# EAGLE design gol (EAGLE 9.6.2)
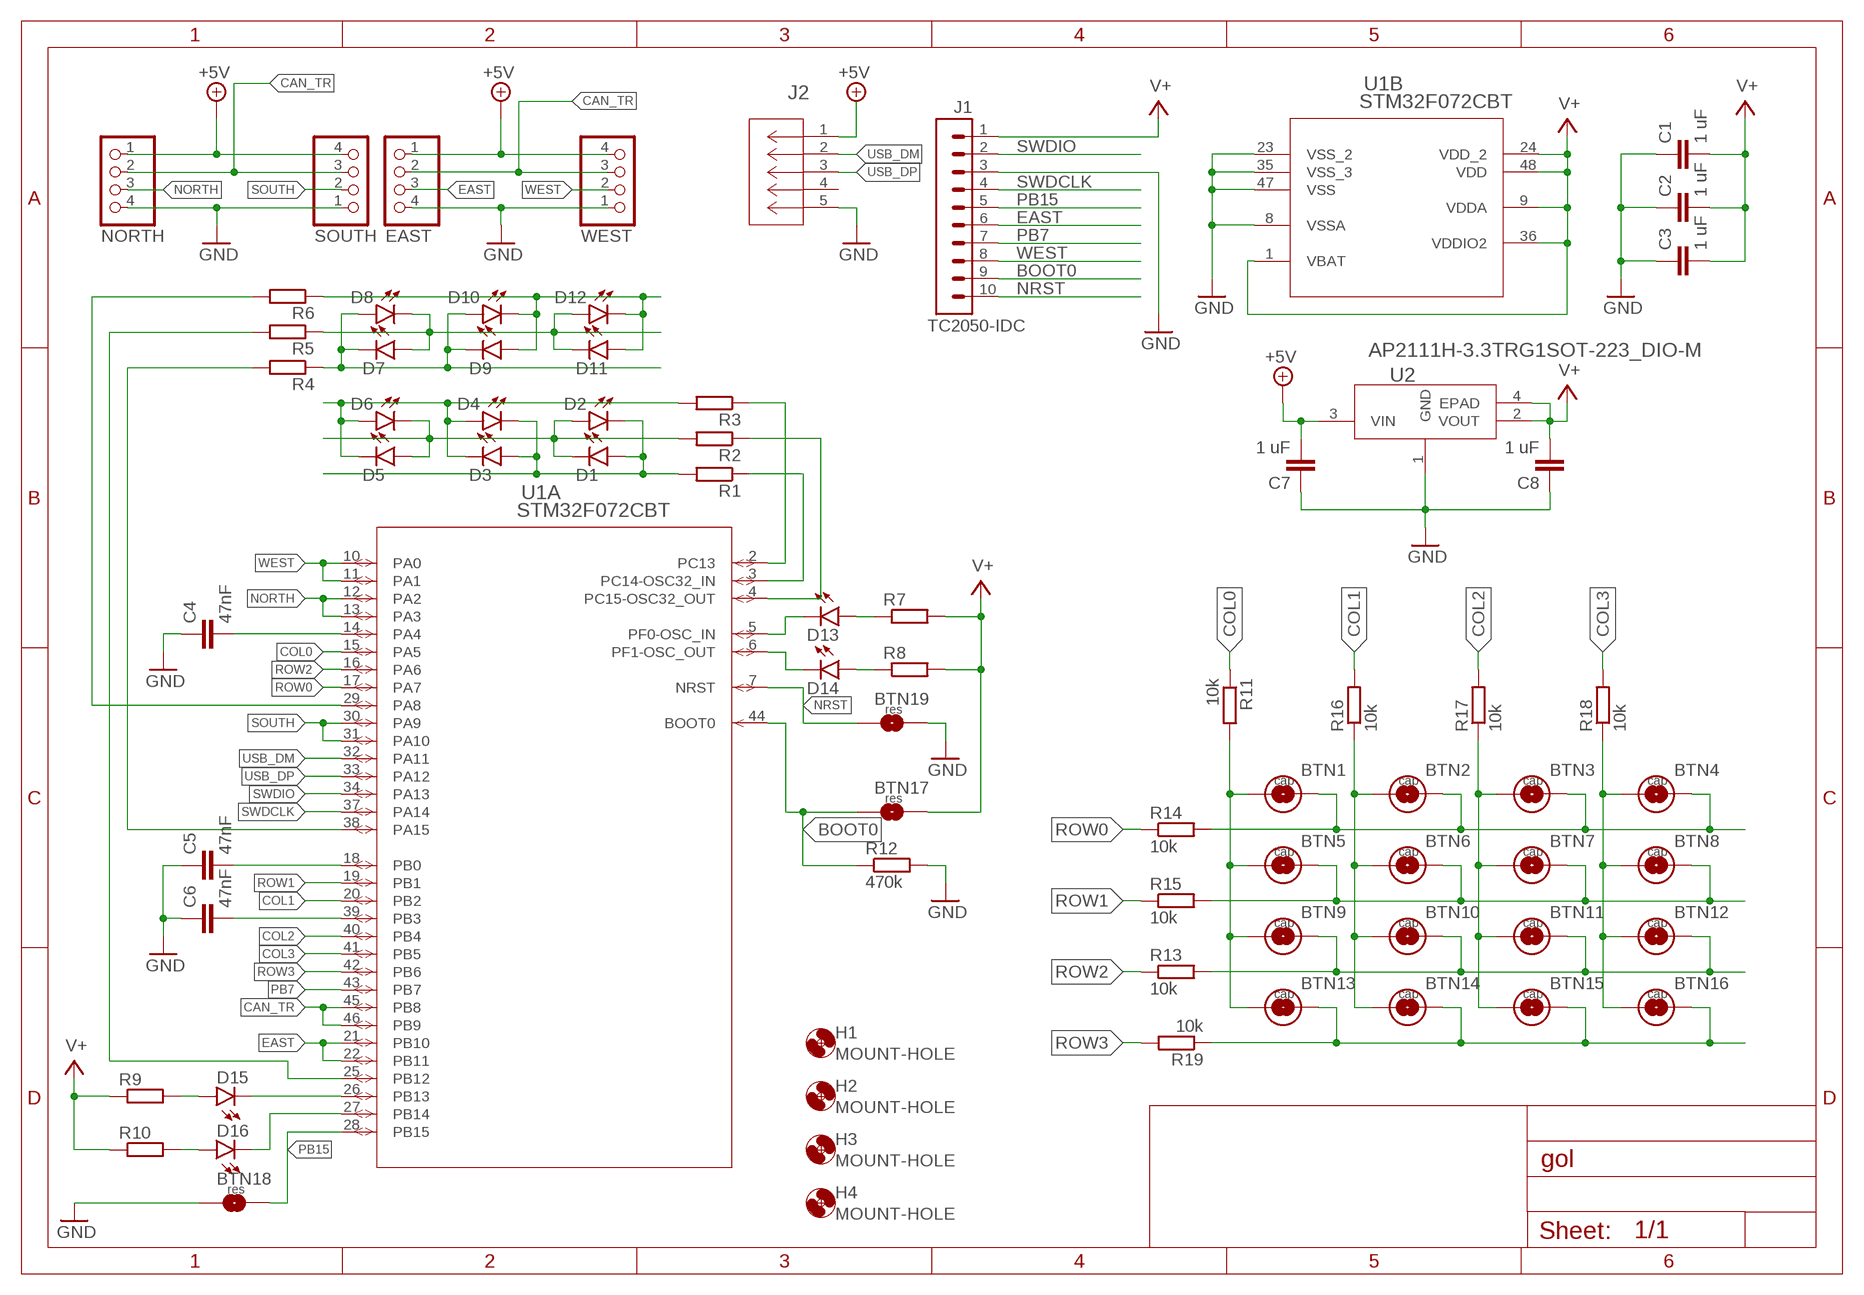
[diagram p0: schematic, sheet 1]

## Parts
BTN1  BUTTON-CAP  [COMB]
BTN2  BUTTON-CAP  [COMB]
BTN3  BUTTON-CAP  [COMB]
BTN4  BUTTON-CAP  [COMB]
BTN5  BUTTON-CAP  [COMB]
BTN6  BUTTON-CAP  [COMB]
BTN7  BUTTON-CAP  [COMB]
BTN8  BUTTON-CAP  [COMB]
BTN9  BUTTON-CAP  [COMB]
BTN10  BUTTON-CAP  [COMB]
BTN11  BUTTON-CAP  [COMB]
BTN12  BUTTON-CAP  [COMB]
BTN13  BUTTON-CAP  [COMB]
BTN14  BUTTON-CAP  [COMB]
BTN15  BUTTON-CAP  [COMB]
BTN16  BUTTON-CAP  [COMB]
BTN17  FLASH  BUTTON-RES  [COMB_EXPOSED]
BTN18  MENU  BUTTON-RES  [COMB_EXPOSED]
BTN19  RESET  BUTTON-RES  [COMB_EXPOSED]
C1  1 uF  C-EUC0603  [C0603]
C2  1 uF  C-EUC0603  [C0603]
C3  1 uF  C-EUC0603  [C0603]
C4  47nF  C-EUC0603  [C0603]
C5  47nF  C-EUC0603  [C0603]
C6  47nF  C-EUC0603  [C0603]
C7  1 uF  C-EUC0603  [C0603]
C8  1 uF  C-EUC0603  [C0603]
D1  LED-5MM  [LED5MM]
D2  LED-5MM  [LED5MM]
D3  LED-5MM  [LED5MM]
D4  LED-5MM  [LED5MM]
D5  LED-5MM  [LED5MM]
D6  LED-5MM  [LED5MM]
D7  LED-5MM  [LED5MM]
D8  LED-5MM  [LED5MM]
D9  LED-5MM  [LED5MM]
D10  LED-5MM  [LED5MM]
D11  LED-5MM  [LED5MM]
D12  LED-5MM  [LED5MM]
D13  LED-5MM  [LED5MM]
D14  LED-5MM  [LED5MM]
D15  LED-5MM  [LED5MM]
D16  LED-5MM  [LED5MM]
EAST  EAST  PINHD-1X04  [1X04]
H1  MOUNT-HOLE  [MOUNT-HOLE-2,8]
H2  MOUNT-HOLE  [MOUNT-HOLE-2,8]
H3  MOUNT-HOLE  [MOUNT-HOLE-2,8]
H4  MOUNT-HOLE  [MOUNT-HOLE-2,8]
J1  TC2050-IDC  [TC2050-IDC]
J2  2057-MCR-B-S-RA-TSMT-NP-CS4-T/RCT-ND  10118192-0002LFCONN_10118192-0002LF_AMP  [CONN_10118192-0002LF_AMP]
NORTH  NORTH  PINHD-1X041X04-RA-FEM  [JP4-RA-FEM]
R1  R-EU-0207/8  [0207/8]
R2  R-EU-0207/8  [0207/8]
R3  R-EU-0207/8  [0207/8]
R4  R-EU-0207/8  [0207/8]
R5  R-EU-0207/8  [0207/8]
R6  R-EU-0207/8  [0207/8]
R7  R-EU-0207/8  [0207/8]
R8  R-EU-0207/8  [0207/8]
R9  R-EU-0207/8  [0207/8]
R10  R-EU-0207/8  [0207/8]
R11  10k  R-EU_R0603  [R0603]
R12  470k  R-EU_R0603  [R0603]
R13  10k  R-EU_R0603  [R0603]
R14  10k  R-EU_R0603  [R0603]
R15  10k  R-EU_R0603  [R0603]
R16  10k  R-EU_R0603  [R0603]
R17  10k  R-EU_R0603  [R0603]
R18  10k  R-EU_R0603  [R0603]
R19  10k  R-EU_R0603  [R0603]
SOUTH  SOUTH  PINHD-1X4/90  [1X04/90]
U1  STM32F072CBT  STM32F072CBT6LQFP48-7X7MM  [LQFP48-7X7MM]
U2  AP2111H-3.3TRG1SOT-223_DIO-M  [SOT-223_DIO-M]
WEST  WEST  PINHD-1X04  [1X04]

## Nets
+5V: C7.2 EAST.1 J2.1 NORTH.1 SOUTH.4 U2.3(VIN) WEST.4
BOOT0: BTN17.P$1 J1.9 R12.1 U1.44(A:BOOT0)
CAN_TR: EAST.2 NORTH.2 SOUTH.3 U1.45(A:PB8) U1.46(A:PB9) WEST.3
COL0: R11.1 U1.15(A:PA5)
COL1: R16.2 U1.20(A:PB2)
COL2: R17.2 U1.40(A:PB4)
COL3: R18.2 U1.41(A:PB5)
EAST: EAST.3 J1.6 U1.21(A:PB10) U1.22(A:PB11)
GND: BTN18.P$1 BTN19.P$2 C1.1 C2.1 C3.1 C4.1 C5.1 C6.1 C7.1 C8.1 EAST.4 J1.3 J2.5 NORTH.4 R12.2 SOUTH.1 U1.8(B:VSSA) U1.23(B:VSS_2) U1.35(B:VSS_3) U1.47(B:VSS) U2.1(GND) WEST.1
IN_COL0: BTN1.P$1 BTN5.P$1 BTN9.P$1 BTN13.P$1 R11.2
IN_COL1: BTN2.P$1 BTN6.P$1 BTN10.P$1 BTN14.P$1 R16.1
IN_COL2: BTN3.P$1 BTN7.P$1 BTN11.P$1 BTN15.P$1 R17.1
IN_COL3: BTN4.P$1 BTN8.P$1 BTN12.P$1 BTN16.P$1 R18.1
IN_ROW0: BTN1.P$2 BTN2.P$2 BTN3.P$2 BTN4.P$2 R14.2
IN_ROW1: BTN5.P$2 BTN6.P$2 BTN7.P$2 BTN8.P$2 R15.2
IN_ROW2: BTN9.P$2 BTN10.P$2 BTN11.P$2 BTN12.P$2 R13.2
IN_ROW3: BTN13.P$2 BTN14.P$2 BTN15.P$2 BTN16.P$2 R19.1
N$1: C4.2 U1.14(A:PA4)
N$2: C5.2 U1.18(A:PB0)
N$3: C6.2 U1.39(A:PB3)
N$4: D1.A D2.K(C) D3.A D4.K(C) R1.2
N$5: D1.K(C) D2.A D5.A D6.K(C) R2.2
N$6: D3.K(C) D4.A D5.K(C) D6.A R3.2
N$13: D7.K(C) D8.A D9.K(C) D10.A R4.1
N$14: D7.A D8.K(C) D11.K(C) D12.A R5.1
N$15: D9.A D10.K(C) D11.A D12.K(C) R6.1
N$18: D13.A R7.1
N$19: D14.A R8.1
N$22: D15.A R9.2
N$23: D16.A R10.2
NORTH: NORTH.3 U1.12(A:PA2) U1.13(A:PA3)
NRST: BTN19.P$1 J1.10 U1.7(A:NRST)
OUTA-L1: R3.1 U1.2(A:PC13)
OUTA-L2: R1.1 U1.3(A:PC14-OSC32_IN)
OUTA-L3: R2.1 U1.4(A:PC15-OSC32_OUT)
OUTB-L1: R4.2 U1.38(A:PA15)
OUTB-L2: R5.2 U1.25(A:PB12)
OUTB-L3: R6.2 U1.29(A:PA8)
OUTD13: D13.K(C) U1.5(A:PF0-OSC_IN)
OUTD14: D14.K(C) U1.6(A:PF1-OSC_OUT)
OUTD15: D15.K(C) U1.26(A:PB13)
OUTD16: D16.K(C) U1.27(A:PB14)
PB7: J1.7 U1.43(A:PB7)
PB15: BTN18.P$2 J1.5 U1.28(A:PB15)
ROW0: R14.1 U1.17(A:PA7)
ROW1: R15.1 U1.19(A:PB1)
ROW2: R13.1 U1.16(A:PA6)
ROW3: R19.2 U1.42(A:PB6)
SOUTH: SOUTH.2 U1.30(A:PA9) U1.31(A:PA10)
SWDCLK: J1.4 U1.37(A:PA14)
SWDIO: J1.2 U1.34(A:PA13)
USB_DM: J2.2 U1.32(A:PA11)
USB_DP: J2.3 U1.33(A:PA12)
V+: BTN17.P$2 C1.2 C2.2 C3.2 C8.2 J1.1 R7.2 R8.2 R9.1 R10.1 U1.1(B:VBAT) U1.9(B:VDDA) U1.24(B:VDD_2) U1.36(B:VDDIO2) U1.48(B:VDD) U2.2(VOUT) U2.4(EPAD)
WEST: J1.8 U1.10(A:PA0) U1.11(A:PA1) WEST.2
Unconnected: J2.4

## Library data of the parts
BTN1-BTN16 = parts:BUTTON-CAP
BTN17-BTN19 = parts:BUTTON-RES
C1-C8 = rcl:C-EU: CAPACITOR, European symbol; SPICEPREFIX: C
D1-D16 = parts:LED-5MM
EAST NORTH WEST = parts:PINHD-1X04
H1-H4 = parts:MOUNT-HOLE
J1 = tcs:TC2050-IDC: Tag Connect 10-pin header
J2 = parts:10118192-0002LF; COPYRIGHT: Copyright (C) 2023 Ultra Librarian. All rights reserved.; DIGIKEY_PART_1: 609-5379-1-ND; DIGIKEY_PART_2: 2057-MCR-B-S-RA-TSMT-NP-CS4-T/RCT-ND; MANUFACTURER_PART_NUMBER: 10118192-0002LF; MFR_NAME: Amphenol ICC
R1-R10 = parts:R-EU-0207/8
R11-R19 = rcl:R-EU_: RESISTOR, European symbol; SPICEPREFIX: R
SOUTH = pinhead:PINHD-1X4: PIN HEADER
U1 = 2023-06-09_13-17-44_Library:STM32F072CBT6; COPYRIGHT: Copyright (C) 2023 Ultra Librarian. All rights reserved.; MANUFACTURER_PART_NUMBER: STM32F072CBT6; MFR_NAME: STMicroelectronics
U2 = parts:AP2111H-3.3TRG1; COPYRIGHT: Copyright (C) 2023 Ultra Librarian. All rights reserved.; MANUFACTURER_PART_NUMBER: AP2111H-3.3TRG1; MFR_NAME: Diodes Inc

## Board
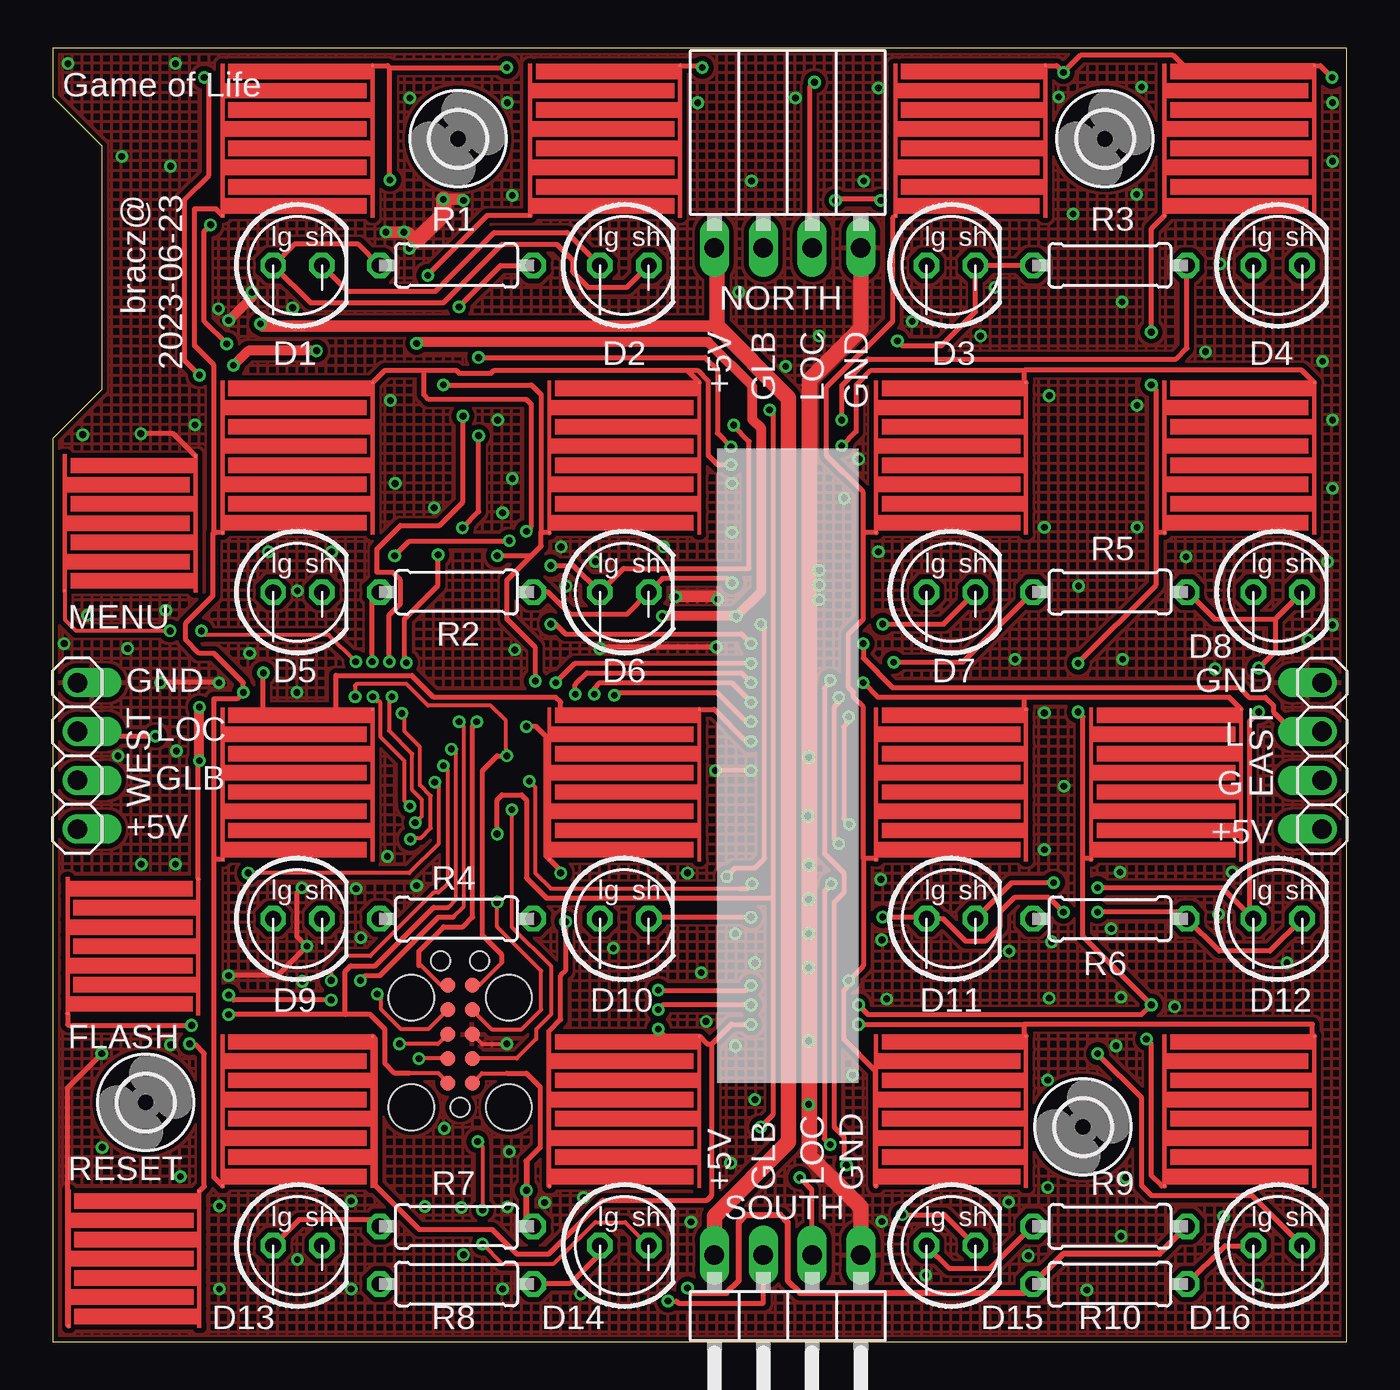
[diagram p1: board, top side]
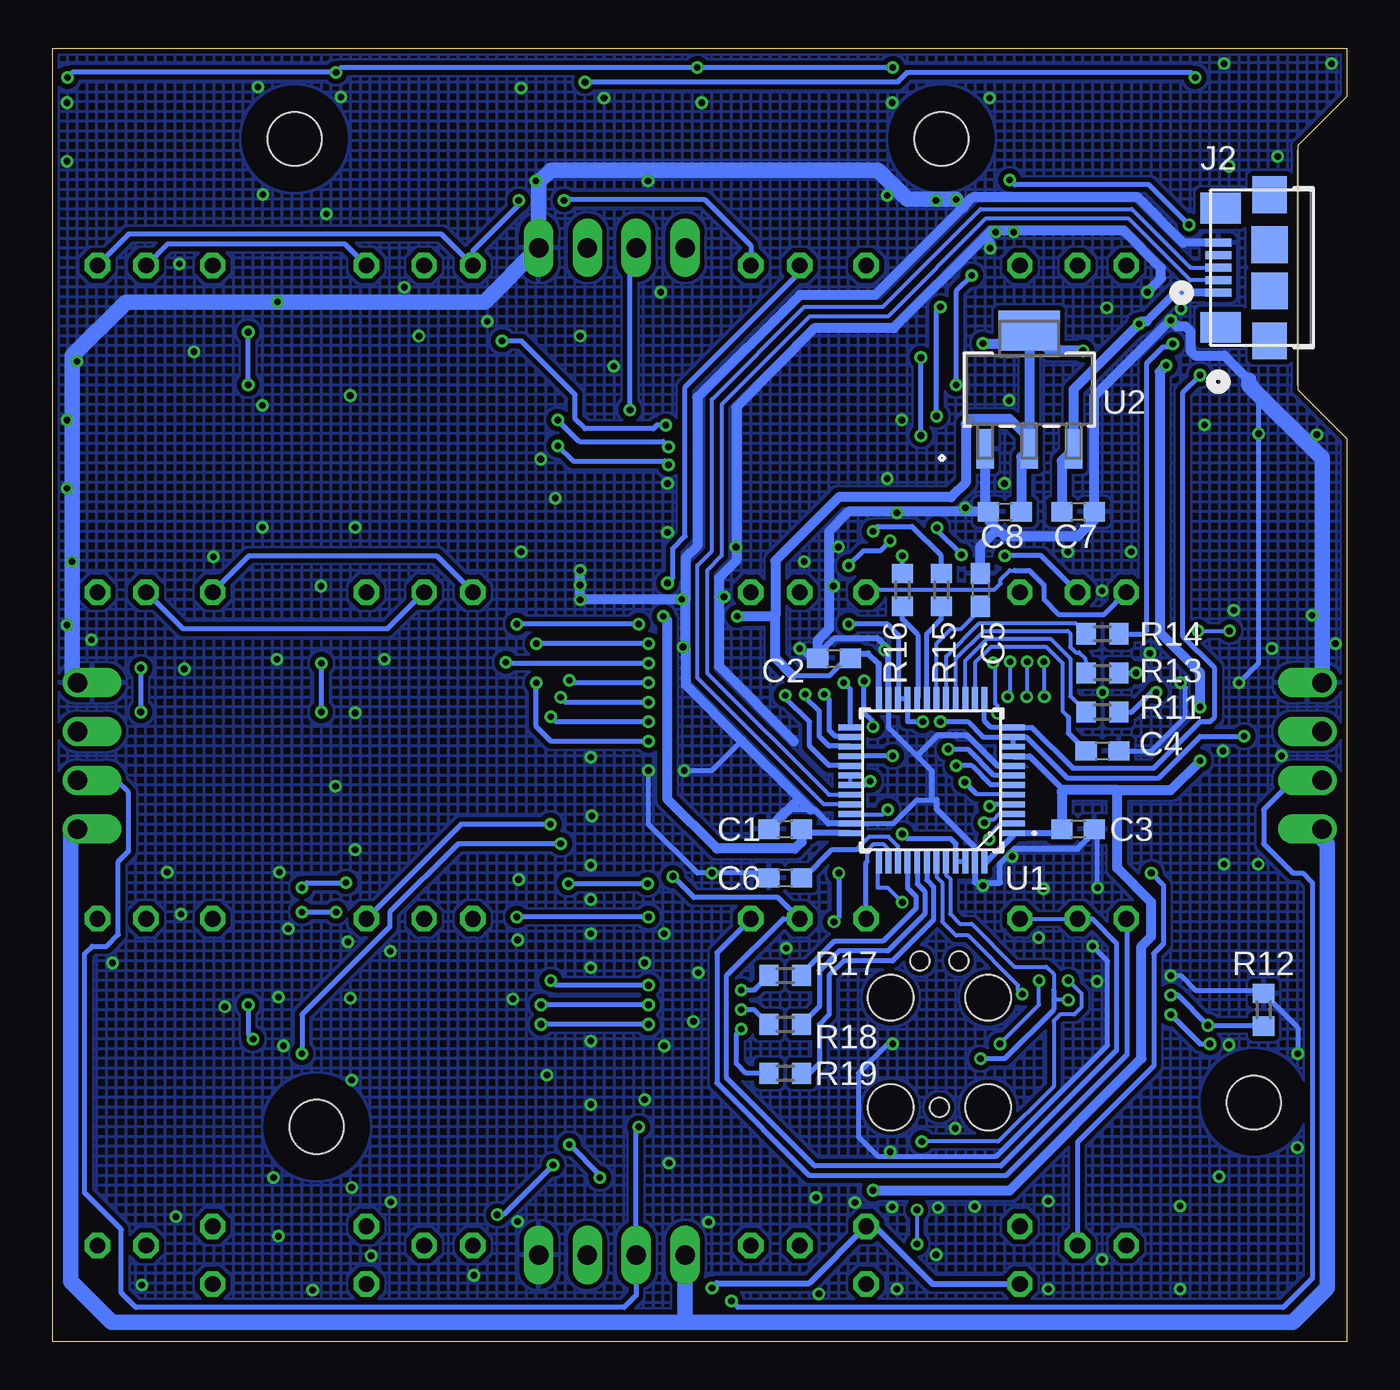
[diagram p2: board, bottom side, seen from below]

Size 67.31 x 67.31 mm. Coordinates in mm from the lower left corner, seen from the top.
Outline: 0,0 67.31,0 67.31,67.31 0,67.31 0,64.77 2.54,62.23 2.54,49.53 0,46.99 0,0
Copper layers (1*16): Top 0.035mm / dielectric 1.5mm / Bottom 0.035mm
Design rules "SeeedStudio_2layer_DRU_no_angle_20140221": minimum track width 6mil, minimum drill 12mil, track to track 6mil, track to pad 6mil, pad to pad 6mil, via to via 6mil, smd to smd 0mil, copper to edge 10mil, drill to drill 10mil, minimum pad ring 10mil, minimum via ring 6mil, stop-mask expansion 2mil, vias tented up to drill 100mil, thermal gap 10mil

### Footprints (pad centres in the part's own frame; a part is rotated, then mirrored left to right if it is on the bottom)
COMB = smd 0.1 x 0.1: P$1 -3.9,-3.9; P$2 3.9,3.9
COMB_EXPOSED = smd 0.1 x 0.1: P$1 -3.3,-3.5; P$2 3.5,3.5
C0603 = smd 1.1 x 1: 1 -0.85,0; 2 0.85,0
LED5MM = drill 0.813 octagon: A -1.27,0; K 1.27,0
1X04 = drill 1.016 offset: 1 -3.81,0; 2 -1.27,0; 3 1.27,0; 4 3.81,0
MOUNT-HOLE-2,8 = hole 2.8: 0,0
TC2050-IDC = smd 0.787 x 0.787: 1 -2.54,-0.635; 2 -1.27,-0.635; 3 0,-0.635; 4 1.27,-0.635; 5 2.54,-0.635; 6 2.54,0.635; 7 1.27,0.635; 8 0,0.635; 9 -1.27,0.635; 10 -2.54,0.635 | hole 0.991: -3.81,0; 3.81,1.016; 3.81,-1.016 | hole 2.375: -3.81,-2.54; 1.905,-2.54; 1.905,2.54; -3.81,2.54
CONN_10118192-0002LF_AMP = smd 0.406 x 1.346: 1 -1.3,2.204; 2 -0.65,2.204; 3 0,2.204; 4 0.65,2.204; 5 1.3,2.204 | smd 1.6 x 2.108: 6 -3.1,2.079; 7 3.1,2.079 | smd 1.905 x 1.803: 8 -3.8,-0.471; 9 3.8,-0.471 | smd 1.905 x 1.905: 10 -1.2,-0.471; 11 1.2,-0.471
JP4-RA-FEM = drill 1.016 long: 1 -3.81,-3.81; 2 -1.27,-3.81; 3 1.27,-3.81; 4 3.81,-3.81
0207/8 = drill 0.813 octagon: 1 -4,0; 2 4,0
R0603 = smd 1 x 1.1: 1 -0.85,0; 2 0.85,0
1X04/90 = drill 1.016 long: 1 -3.81,-3.81; 2 -1.27,-3.81; 3 1.27,-3.81; 4 3.81,-3.81
LQFP48-7X7MM = smd 1.194 x 0.305: 1 -4.25,2.75; 2 -4.25,2.25; 3 -4.25,1.75; 4 -4.25,1.25; 5 -4.25,0.75; 6 -4.25,0.25; 7 -4.25,-0.25; 8 -4.25,-0.75; 9 -4.25,-1.25; 10 -4.25,-1.75; 11 -4.25,-2.25; 12 -4.25,-2.75; 25 4.25,-2.75; 26 4.25,-2.25; 27 4.25,-1.75; 28 4.25,-1.25; 29 4.25,-0.75; 30 4.25,-0.25; 31 4.25,0.25; 32 4.25,0.75; 33 4.25,1.25; 34 4.25,1.75; 35 4.25,2.25; 36 4.25,2.75 | smd 0.305 x 1.194: 13 -2.75,-4.25; 14 -2.25,-4.25; 15 -1.75,-4.25; 16 -1.25,-4.25; 17 -0.75,-4.25; 18 -0.25,-4.25; 19 0.25,-4.25; 20 0.75,-4.25; 21 1.25,-4.25; 22 1.75,-4.25; 23 2.25,-4.25; 24 2.75,-4.25; 37 2.75,4.25; 38 2.25,4.25; 39 1.75,4.25; 40 1.25,4.25; 41 0.75,4.25; 42 0.25,4.25; 43 -0.25,4.25; 44 -0.75,4.25; 45 -1.25,4.25; 46 -1.75,4.25; 47 -2.25,4.25; 48 -2.75,4.25
SOT-223_DIO-M = smd 0.902 x 2.066: 1 -2.3,-3.076; 2 0,-3.076; 3 2.3,-3.076 | smd 3.202 x 2.066: 4 0,3.076

### Placement (x,y rotation side)
BTN1  12.73,62.49 0 top
BTN2  28.73,62.49 0 top
BTN3  47.73,62.49 0 top
BTN4  61.73,62.49 0 top
BTN5  12.73,46 0 top
BTN6  29.73,46 0 top
BTN7  46.73,46 0 top
BTN8  61.73,46 0 top
BTN9  12.73,29 0 top
BTN10  29.73,29 0 top
BTN11  46.73,29 0 top
BTN12  57.92,29 0 top
BTN13  12.73,12 0 top
BTN14  29.73,12 0 top
BTN15  46.73,12 0 top
BTN16  61.73,12 0 top
BTN17  4.06,20.57 0 top
BTN18  4.12,42.59 180 top
BTN19  4.32,4.32 180 top
C1  29.21,26.67 0 bottom
C2  26.67,35.56 0 bottom
C3  13.97,26.67 180 bottom
C4  12.7,30.73 180 bottom
C5  19.05,39.12 270 bottom
C6  29.21,24.13 0 bottom
C7  13.97,43.18 180 bottom
C8  17.78,43.18 0 bottom
D1  12.73,56 0 top
D2  29.73,56 0 top
D3  46.73,56 0 top
D4  63.73,56 0 top
D5  12.73,39 0 top
D6  29.73,39 0 top
D7  46.73,39 0 top
D8  63.73,39 0 top
D9  12.73,22 0 top
D10  29.73,22 0 top
D11  46.73,22 0 top
D12  63.73,22 0 top
D13  12.73,5 0 top
D14  29.73,5 0 top
D15  46.73,5 0 top
D16  63.73,5 0 top
EAST  66.04,30.48 90 top
H1  54.74,62.59 0 top
H2  53.59,11.18 0 top
H3  4.83,12.45 0 top
H4  21.08,62.59 0 top
J1  21.18,16 90 top
J2  4.47,55.88 90 bottom
NORTH  38.23,60.73 0 top
R1  21,56 180 top
R2  21,39 0 top
R3  55,56 180 top
R4  21,22 0 top
R5  55,39 180 top
R6  55,22 180 top
R7  21,6 0 top
R8  21,3 180 top
R9  55,6 180 top
R10  55,3 0 top
R11  12.7,32.77 0 bottom
R12  4.32,17.27 90 bottom
R13  12.7,34.8 0 bottom
R14  12.7,36.83 0 bottom
R15  21.08,39.12 90 bottom
R16  23.11,39.12 270 bottom
R17  29.21,19.05 0 bottom
R18  29.21,16.51 0 bottom
R19  29.21,13.97 0 bottom
SOUTH  38.23,0.7 180 top
U1  21.59,29.21 180 bottom
U2  16.51,49.53 0 bottom
WEST  1.27,30.48 270 top

### Tracks (layer width: path | path; a pad name or v marks a point on that pad's centre or on a via)
+5V  (via drill 0.35)
  Top 0.61: v10.79,52.96 10.92,52.83 34.54,52.83
  Top 0.813: NORTH.1 34.54,56.8 34.54,52.83 38.28,49.1 38.28,10.39 34.42,6.53 SOUTH.4
  Bottom 0.406: J2.1 8.92,54.58 10.41,53.09
  Bottom 0.508: 10.41,53.09 10.67,53.09 v10.79,52.96 14.21,49.54 U2.3 14.82,45.84 C7.2
  Bottom 0.813: WEST.4 1.27,26.16 1.02,25.91 1.02,2.79 2.79,1.02 34.29,1.02 | 34.29,1.02 34.42,1.15 SOUTH.4 | EAST.1 66.4,26.31 66.4,3.15 64.26,1.02 34.29,1.02
BOOT0  (via drill 0.35)
  Top 0.203: J1.9 v19.05,14.73
  Top 0.254: BTN17.P$1 0.76,16.51 0.81,16.46 v7.21,16.46 | v9.14,18.03 9.4,17.78 v14.48,17.78
  Bottom 0.203: U1.44 20.84,24.29 20.62,24.08 20.62,22.25 20.12,21.74 19.51,21.74 17.27,19.51 15.62,19.51 15.24,19.13 15.24,18.29 | v14.48,17.78 15.24,17.78
  Bottom 0.254: v19.05,14.73 17.78,14.73 15.24,17.27 15.24,17.78 15.24,18.29 | v9.14,18.03 8.79,18.03 v7.21,16.46 4.43,16.46 4.35,16.46 R12.1
CAN_TR  (via drill 0.35)
  Top 0.254: v23.11,26.42 23.11,28.19 23.37,28.45 24.38,28.45 24.64,28.19 24.64,24.13 25.68,23.09 37.49,23.09 | v36.83,11.18 37.49,11.84 37.49,23.09 | v37.29,48.49 37.49,48.28 37.49,23.09 | v32,2.11 32.43,2.11 32.54,2.01 36.96,2.01 SOUTH.3
  Bottom 0.254: U1.46 U1.45 20.32,24.98 20.32,25.91 20.57,26.16 22.86,26.16 v23.11,26.42 | v36.83,11.18 36.96,11.05 SOUTH.3 36.96,2.41 37.59,1.78 62.99,1.78 63.75,2.54 63.75,5.84 65.66,7.75 65.66,20.19 65.28,20.57 64.52,20.57 63.91,21.18 63.91,24.99 63.37,25.53 63.37,28.57 64.01,29.21 EAST.2 | v37.29,48.49 37.29,56.59 NORTH.2 | WEST.3 2.79,29.21 4.32,27.69 4.32,25.91 2.79,24.38 2.29,24.38 1.78,23.88 1.78,3.3 3.3,1.78 31.67,1.78 v32,2.11
COL0
  Bottom 0.203: U1.15 19.84,35.43 18.69,36.58 15.42,36.58 14.38,35.53 14.38,33.59 R11.1
  Bottom 0.254: U1.15
COL1
  Bottom 0.254: U1.20 22.32,33.48 22.32,36.79 23.11,37.59 R16.2
COL2
  Bottom 0.254: U1.40 22.84,23.6 22.4,23.16 22.4,22.55 24.13,20.83 26.67,20.83 28.36,19.14 R17.2
COL3
  Bottom 0.254: U1.41 22.34,23.81 21.95,23.42 21.95,22.25 23.88,20.32 26.42,20.32 27.43,19.3 27.43,17.44 R18.2
EAST  (via drill 0.35)
  Top 0.203: J1.6 20.19,18.54 19.17,19.56 19.05,19.56
  Top 0.254: 19.05,19.56 19.05,20.32 20.32,21.59 21.34,21.59 21.84,22.1 21.84,32.05 v22.05,32.26 | v25.91,37.34 26.16,37.34 26.67,36.83 35.81,36.83 v36.32,36.32 | v42.16,36.32 42.16,35.56 43.69,34.04 61.72,34.04 62.23,33.53 63.09,33.53 63.5,33.12 63.5,32.77 64.52,31.75 EAST.3
  Bottom 0.254: v22.05,32.26 22.84,32.26 U1.21 U1.22 23.32,33.48 23.32,36.78 23.88,37.34 v25.91,37.34 | v36.32,36.32 v42.16,36.32
GND  (via drill 0.35)
  Top 0.203: J1.3 22.32,15.49 v23.62,15.49
  Top 0.254: v34.52,36.14 28.52,36.14 v28.45,36.07 | v12.95,23.62 12.7,23.37 12.7,21.08 v13.21,20.57 11.68,19.05 v9.14,19.05 | BTN19.P$2 0.76,0.87 0.76,13.21 v2.54,14.99 | v8.64,34.29 v5.59,34.29 | v36.32,29.72 v34.47,29.72 | BTN18.P$1 6.26,47.24 v4.57,47.24
  Top 0.508: v9.14,53.14 10.36,54.36 v10.36,54.61 | v39.88,40.13 39.37,40.13 | v39.88,39.37 39.37,39.37 | v39.88,38.61 39.37,38.61
  Top 0.61: v34.59,38.63 34.47,38.76 v32.39,38.76 | v20.32,59.44 21.31,59.44 v21.36,59.38 | v18.54,56.9 18.92,57.28 18.47,57.73 17.3,57.73
  Top 0.813: NORTH.4 42.04,52.71 39.37,50.04 39.37,40.13 39.37,39.37 39.37,38.61 39.37,9.65 42.04,6.98 SOUTH.1 | 18.92,57.28 20.32,58.67 v20.32,59.44
  Bottom 0.254: U1.35 23.59,26.96 22.35,28.19 21.59,28.19 21.34,28.19 | U1.23 23.84,31.97 22.35,30.48 21.59,29.72 | 34.39,36.07 34.45,36.07 v34.52,36.14 | v28.45,36.07 27.94,35.56 C2.1 | v23.62,15.49 23.88,15.49 25.4,13.97 25.4,10.67 24.38,9.65 18.21,9.65 12.45,15.42 12.45,19.81 v13.21,20.57 | v12.95,23.62 12.95,26.34 13.12,26.5 | v2.54,14.99 2.54,16.34 R12.2 4.48,18.29 7.87,18.29 8.64,19.05 v9.14,19.05 | C4.1 10.16,30.73 8.38,32.51 8.38,34.04 v8.64,34.29 | v5.59,34.29 4.57,35.31 v4.57,47.24 4.57,49.53 4.83,49.78 | C6.1 30.31,24.38 33.78,24.38 36.32,26.92 v36.32,29.72 | v34.47,29.72 33.02,29.72 31.47,31.27
  Bottom 0.305: U1.23 23.84,36.03 24.38,36.58 26.67,36.58 27.52,35.73 C2.1 | U1.35 26.96,26.96 27.69,27.69 27.89,27.69 29.21,27.69 30.06,26.84 C1.1 | C3.1 13.12,26.5 13.97,25.65 17.27,25.65 18.03,24.89 18.03,23.88 19.3,23.88 19.34,23.91 U1.47 19.34,25.71 21.34,27.71 21.34,28.19 | U1.8 18.15,29.96 19.74,31.55 21.29,31.55 22.35,30.48 | 21.59,29.72 21.59,28.19 | v32.39,38.76 32.66,38.76
  Bottom 0.406: J2.5 8.51,57.18
  Bottom 0.508: U2.1 18.81,43.36 C8.1 | C8.1 18.63,42.76 18.03,42.16 | 18.03,42.16 17.78,41.91 13.97,41.91 13.12,42.76 C7.1 13.12,49.21 9.2,53.14 v9.14,53.14 8.84,52.83 8.38,52.83 8.13,52.58 8.13,51.56 7.87,51.31 6.35,51.31 5.08,50.04 4.83,49.78 | C5.1 19.05,41.4 18.29,42.16 18.03,42.16 | C8.1 25.91,43.18 26.92,42.16 26.92,37.08 27.52,36.49 27.52,35.73 | 8.51,57.18 10.87,59.54 19.46,59.54 19.94,59.05 24.54,54.46 28.45,54.46 33.78,49.15 33.78,41.4 34.39,40.79 34.39,38.63 | 34.39,38.63 34.39,36.07 34.39,34.19 31.47,31.27 28.55,28.35 | 28.55,28.35 27.89,27.69 | C1.1 28.55,28.18 28.55,28.35 | v10.36,54.61 9.65,55.32 9.65,55.87 11.59,57.81 18.49,57.81 18.85,57.45 | 18.85,57.45 23.57,52.73 27.69,52.73 31.75,48.62 31.75,40.64 32.66,39.73 32.66,38.76 32.66,35.15 28.75,31.24 | v39.88,40.13 v39.88,39.37 v39.88,38.61 39.85,38.63 v34.59,38.63 34.39,38.63 | 18.85,57.45 18.54,57.15 v18.54,56.9
  Bottom 0.61: 19.94,59.05 v20.32,59.44
  Bottom 0.813: EAST.4 66.29,34.54 66.29,51.31 63.5,54.1 44.86,54.1 NORTH.4 42.04,60.32 41.4,60.96 24.38,60.96 22.86,59.44 v20.32,59.44 | WEST.1 1.27,45.97 5.08,49.78 5.08,50.04
  other vias: 56.64,65.28 53.09,58.67 56.39,59.69 55.63,54.1 48.26,52.32 49.02,54.86 44.7,53.09 39.88,52.32 35.69,54.61 41.94,45.92 51.84,49.23 56.41,48.72 51.59,42.37 56.41,42.37 58.95,40.84 66.32,40.59 53.37,39.32 50.06,35.51 55.65,35.51 60.48,35 65.3,36.53 51.59,32.72 51.59,25.6 52.6,28.91 61.37,24.43 55.52,24.43 51.97,20.8 55.58,17.93 51.84,17.88 49.76,20.32 43.38,17.83 43.13,20.9 43.08,24.05 55.07,21.49 58.37,17.42 64.21,19.71 60.66,22.25 55.83,8.53 55.32,15.39 51.77,13.61 51.77,8.03 55.58,5.49 60.91,6.5 62.69,2.95 53.8,2.69 50.75,4.47 45.42,3.45 43.13,6.25 49.73,7.26 35.26,9.3 36.53,12.6 35.51,15.39 36.53,19.71 35.51,21.23 33.73,19.2 29.16,20.47 33.99,16.66 39.32,12.34 39.32,19.46 39.32,21.23 39.32,23.01 39.32,24.79 39.27,27.36 39.32,30.4 41.17,43.89 35.33,42.11 35.33,44.65 31.78,41.35 28.22,40.59 26.44,41.35 26.7,39.32 23.14,47.96 23.9,44.91 23.39,43.13 17.55,48.97 17.81,44.65 19.84,43.38 11.2,41.1 12.73,39.07 14.5,41.1 1.8,37.8 5.87,38.05 7.39,47.7 1.55,47.19 6.12,61.16 3.58,61.67 0.79,66.5 6.38,66.5 18.57,64.72 23.9,59.64 23.65,64.47 38.63,64.72 33.55,64.47 36.35,60.4 42.19,60.4 42.95,65.23 38.13,50.75 59.97,51.51 60.73,56.08 66.07,51 66.57,64.47 66.57,61.42 66.57,47.96 66.57,44.4 66.57,37.29 8.66,7.06 15.52,7.32 8.66,2.74 12.73,4.27 21.36,4.52 23.39,2.74 27.46,2.49 15.52,2.74 6.63,8.59 2.57,10.11 6.12,15.44 6.38,24.84 4.6,24.84 3.38,30.48 6.43,30.73 0.58,36.32 3.89,36.07 10.24,35.81 12.7,33.78 17.4,25.25 18.92,23.72 12.98,18.75 16.03,21.03 15.77,23.57 21.26,6.99 19.35,7.04 23.65,7.01 27.61,7.49 25.58,7.24 33.2,6.22 41.61,13.87 33.02,24.38 39.32,15.65 42.95,41.1 20.37,11.1 23.75,9.88 24.03,35.99 8.61,53.75 12.47,53.8 52.32,64.77 18.26,57.73 17.32,57.73
  pour Top (isolate 0.254, hatched): 0,67.31 67.31,67.31 67.31,0 0,0 0,46.99 2.54,49.53 2.54,62.23 0,64.77
  pour Bottom (isolate 0.254, hatched): 0,67.31 67.31,67.31 67.31,0 0,0 0,46.99 2.54,49.53 2.54,62.23 0,64.77
IN_COL0  (via drill 0.35)
  Top 0.254: BTN13.P$1 8.38,8.55 8.38,25.15 | BTN9.P$1 8.43,25.1 8.38,25.15 | 8.38,25.15 8.38,33.45 9.58,33.45 v9.91,33.78 9.91,34.29 8.38,35.81 7.62,35.81 6.91,36.52 6.91,37.39 8.33,38.81 8.33,42.06 8.38,42.16 | BTN5.P$1 8.45,42.1 8.38,42.16 | 8.38,42.16 8.38,50.8 7.37,51.82 7.37,58.93 8.49,58.93 BTN1.P$1
  Bottom 0.254: R11.2 11.18,32.77 10.16,33.78 v9.91,33.78
IN_COL1  (via drill 0.35)
  Top 0.254: BTN2.P$1 22.59,58.59 19.51,55.5 v19.51,55.47 | v20.32,49.78 24.89,49.78 25.4,49.28 25.4,42.16 | 25.4,42.16 25.4,41.4 24.89,40.89 | BTN6.P$1 25.46,42.1 25.4,42.16 | v24.64,32 25.15,32 25.65,31.5 25.65,25.28 BTN10.P$1 26.42,24.51 v26.42,24.38 | v25.1,34.38 25.1,36.11 23.62,37.59 23.62,39.62 24.89,40.89 | v26.67,21.84 26.67,19.3 26.42,19.05 26.42,16.76 25.81,16.15 25.81,8.12 BTN14.P$1 | v23.11,40.89 24.89,40.89
  Bottom 0.254: v19.51,55.47 20.32,54.66 v20.32,49.78 | v24.64,32 24.64,32.26 25.1,32.72 v25.1,34.38 | v26.42,24.38 26.42,22.1 v26.67,21.84 | R16.1 v23.11,40.89
IN_COL2  (via drill 0.35)
  Top 0.254: v31.5,18.29 36.07,18.29 v36.32,18.54 | 42.16,25.15 42.16,19.56 v41.4,18.8 41.4,18.54 41.15,18.29 41.15,15.75 42.8,14.1 42.8,8.13 BTN15.P$1 | BTN11.P$1 42.78,25.15 42.16,25.15 | 42.16,25.15 42.16,33.02 41.66,33.53 41.66,33.78 41.4,34.04 41.4,36.83 42.16,37.59 42.16,42.16 | 42.16,42.16 42.16,44.2 40.26,46.1 40.26,49.66 43.69,53.09 43.69,58.45 BTN3.P$1 | BTN7.P$1 42.23,42.1 42.16,42.16
  Bottom 0.254: R17.1 30.82,18.29 v31.5,18.29 | v36.32,18.54 41.15,18.54 v41.4,18.8
IN_COL3  (via drill 0.35)
  Top 0.254: v31.5,17.27 31.75,17.53 v36.32,17.53 | v41.91,17.53 42.42,17.02 56.64,17.02 v57.15,17.53 53.59,21.08 53.59,25.15 | v56.9,15.75 57.15,15.49 57.15,8.64 57.69,8.1 BTN16.P$1 | BTN12.P$1 53.97,25.15 53.59,25.15 | v53.34,32.77 53.59,32.51 53.59,25.15 | v53.34,35.31 57.4,39.37 57.4,42.16 | v57.15,49.78 57.4,49.53 57.4,42.16 | v57.15,52.53 57.15,57.91 BTN4.P$1 | BTN8.P$1 57.47,42.1 57.4,42.16
  Bottom 0.254: v36.32,17.53 v41.91,17.53 | v57.15,17.53 57.15,16 v56.9,15.75 | v53.34,32.77 v53.34,35.31 | v57.15,49.78 v57.15,52.53 | R18.1 30.82,17.27 v31.5,17.27
IN_ROW0  (via drill 0.35)
  Top 0.254: v9.04,51.92 7.87,53.08 7.87,57.78 v8.2,58.12 | v17.53,60.45 17.53,66.29 | BTN1.P$2 17.43,66.39 17.53,66.29 | 17.53,66.29 v23.62,66.29 | BTN2.P$2 33.68,66.39 v33.78,66.29 | BTN3.P$2 52.23,66.39 v52.58,66.04 53.47,66.93 58.29,66.93 58.83,66.39 BTN4.P$2 65.94,66.39 v66.55,65.79
  Bottom 0.254: v9.04,51.92 9.19,51.77 9.54,51.77 10.39,50.92 10.39,37.02 10.58,36.83 R14.2 | v8.2,58.12 10.29,60.2 17.27,60.2 v17.53,60.45 | v23.62,66.29 v33.78,66.29 52.32,66.29 v52.58,66.04 66.29,66.04 v66.55,65.79
IN_ROW1  (via drill 0.35)
  Top 0.254: BTN6.P$2 32.98,50.55 | BTN5.P$2 17.28,50.55 19.3,50.55 | 19.3,50.55 20.98,50.55 21.13,50.39 22.81,50.39 22.96,50.55 32.98,50.55 | BTN8.P$2 64.98,50.55 50.55,50.55 | BTN7.P$2 50.55,49.98 50.55,50.55 | 32.98,50.55 33.53,50.55 34.09,49.99 34.09,46.13 34.59,45.62 v35.28,45.62 | v41.05,46.61 41.78,47.35 41.78,49.76 42.57,50.55 50.55,50.55 | v24.64,42.16 24.89,42.42 24.89,48.77 24.64,49.02 19.56,49.02 19.3,49.28 19.3,50.55
  Bottom 0.254: v35.28,45.62 35.48,45.82 40.26,45.82 v41.05,46.61 | R15.2 21.08,40.89 22.61,42.42 24.38,42.42 v24.64,42.16
IN_ROW2  (via drill 0.35)
  Top 0.203: BTN9.P$2 16.5,32.77
  Top 0.254: BTN12.P$2 61.21,33.51 61.21,33.53 50.55,33.53 | BTN11.P$2 50.55,32.98 50.55,33.53 | v36.32,31.24 36.07,31.24 34.41,32.9 BTN10.P$2 33.5,32.77 26.42,32.77 26.42,33.27 26.16,33.53 19.81,33.53 18.67,34.67 14.73,34.67 14.73,32.77 | v42.16,34.29 42.93,33.53 50.55,33.53 | v10.95,34.8 10.92,34.77 10.92,32.77 14.73,32.77 | 16.5,32.77 14.73,32.77
  Bottom 0.254: v36.32,31.24 41.4,31.24 42.16,32 v42.16,34.29 | R13.2 v10.95,34.8
IN_ROW3  (via drill 0.35)
  Top 0.254: BTN13.P$2 16.76,15.77 16.76,8.13 19.05,5.84 22.86,5.84 24.13,4.57 25.81,4.57 28.6,7.37 34.03,7.37 34.29,7.63 34.29,15.49 | 34.29,15.49 34.04,15.49 BTN14.P$2 31.85,15.9 v31.5,16.26 | 34.29,15.49 35.31,16.51 v36.32,16.51 | v41.91,16.51 50.55,16.51 | BTN15.P$2 50.55,15.98 50.55,16.51 | 50.55,16.51 65.53,16.51 65.53,16 BTN16.P$2
  Bottom 0.254: v36.32,16.51 v41.91,16.51 | R19.1 31.24,13.97 31.75,14.48 31.75,16 v31.5,16.26
N$1
  Bottom 0.203: U1.14 19.33,35.33 18.49,36.17 15.65,36.17 14.78,35.31 14.78,32.82 14.48,32.51
  Bottom 0.254: U1.14 | C4.2 14.48,31.66 14.48,32.51
N$2
  Bottom 0.203: U1.18 21.34,36.06 21.34,36.32 20.57,37.08 20.07,37.08 19.05,38.1
  Bottom 0.254: 19.05,38.1 C5.2
N$3
  Bottom 0.203: U1.39 23.34,25.78 23.82,26.26 24.84,26.26 25.5,25.6
  Bottom 0.254: C6.2 28.25,24.13 26.77,25.6 25.5,25.6
N$4  (via drill 0.35)
  Top 0.254: R1.2 15.9,57.1 12.56,57.1 D1.A 13.41,54.05 20.32,54.05 23.37,57.1 26.21,57.1 27.03,56.29 27.03,55.68 27.84,54.86 29.86,54.86 D2.K | v43.08,59.38 43.03,59.44 40.72,59.44 v40.72,59.38
  Bottom 0.254: D4.K 63.37,57.63 47.09,57.63 D3.A 45.46,56.76 43.08,59.14 v43.08,59.38 | D2.K 31,57.02 33.42,59.44 40.66,59.44 v40.72,59.38
N$5  (via drill 0.35)
  Top 0.254: R2.2 25.77,39 26.92,37.85 29.85,37.85 D6.K 31.71,39.71 35.09,39.71 v35.33,39.47 | D1.K 15.34,54.66 19.91,54.66 22.96,57.71 26.75,57.71 D2.A
  Bottom 0.203: 24.38,39.12 18.33,39.12 18,39.45 18,39.65 17.53,40.13 17.27,40.13
  Bottom 0.254: R2.2 24.75,39 24.64,39.12 24.38,39.12 | 17.27,40.13 16.51,40.13 15.75,39.37 15.75,38.61 14.99,37.85 12.61,37.85 D5.A | v35.33,39.47 35.05,39.75 35.05,41.27 34.42,41.91 34.42,49.66 28.46,55.61 D2.A
N$6  (via drill 0.35)
  Top 0.254: v17.78,40.89 18.54,41.66 23.72,41.66 v23.75,41.68 | v25.91,40.39 27.07,40.39 D6.A 29.69,40.23 36.22,40.23 36.22,46.84 35.42,47.63 v35.42,47.69 | R3.2 D3.K 48,53.59 46.23,51.82 44.2,51.82 v43.94,52.07
  Bottom 0.254: D5.K 15.89,40.89 v17.78,40.89 | v23.75,41.68 24.28,41.15 25.15,41.15 v25.91,40.39 | R3.2 52.1,57.1 61.36,57.1 D4.A | v35.42,47.69 35.87,47.69 36.07,47.5 39.62,47.5 40.13,48.01 40.13,49.28 42.93,52.07 v43.94,52.07
N$13  (via drill 0.35)
  Top 0.254: v35.05,24.2 35.49,24.64 36.52,24.64 37.03,25.15 37.03,37.13 v36.83,37.34 | v43.18,37.34 46.34,37.34 D7.K
  Bottom 0.203: R4.1 D9.K
  Bottom 0.254: D9.K 13.24,22 11.97,20.73 11.97,15.16 17.98,9.14 27.69,9.14 32.26,13.72 32.26,19.05 29.31,22 D10.A 29.57,23.11 33.96,23.11 v35.05,24.2 | v36.83,37.34 v43.18,37.34 | D7.K 49.92,37.08 60.54,37.08 D8.A
N$14  (via drill 0.35)
  Top 0.254: R5.1 59.04,39 60.45,37.59 63.59,37.59 | 63.59,37.59 D8.K | 63.59,37.59 63.59,35.91 v62.74,35.05 | v62.74,32.77 62.25,32.28 62.25,22.21 D12.A 60.84,23.62 v54.36,23.62 | v52.07,23.88 49.88,23.88 D11.K
  Bottom 0.254: R5.1 57.11,40.89 47.35,40.89 D7.A | v62.74,35.05 62.74,34.04 v62.74,32.77 | v54.36,23.62 54.1,23.88 v52.07,23.88
N$15  (via drill 0.35)
  Top 0.254: D12.K 63.32,20.32 60.68,20.32 R6.1 58.65,22.35 v54.36,22.35 | v52.58,22.35 51.82,23.11 50.04,23.11 49.28,22.35 49.28,21.59 48.51,20.83 47.5,20.83 46.33,22 D11.A 45.36,22.1 v43.18,22.1 | D10.K 31.1,22.1 v36.32,22.1
  Bottom 0.254: D9.A 11.43,21.97 11.43,14.94 17.73,8.64 27.94,8.64 32.77,13.46 32.77,20.23 D10.K | v54.36,22.35 v52.58,22.35 | v36.32,22.1 v43.18,22.1
N$18
  Top 0.254: R7.1 16.86,6 16.51,6.35 12.81,6.35 D13.A
N$19
  Top 0.254: R8.1 25.05,3.05 26.92,3.05 28.46,4.58 D14.A
N$22
  Top 0.254: D15.A 46.65,3.81 48.77,3.81 50.96,6 R9.2
N$23
  Top 0.254: R10.2 61,5 D16.A
NORTH  (via drill 0.35)
  Top 0.254: v7.62,50.29 6.86,51.05 6.86,59.44 8.13,60.71 8.13,65.53 v7.87,65.79 | NORTH.3 39.37,57.05 39.37,65.28 v39.62,65.53
  Bottom 0.254: U1.13 18.84,32.3 18.5,31.96 U1.12 16.36,31.96 14.25,29.84 10.03,29.84 7.62,32.26 7.11,32.26 6.86,32.51 6.86,35.05 8.51,36.7 8.51,49.4 v7.62,50.29 | v7.87,65.79 8.13,66.04 22.86,66.04 23.37,65.53 v39.62,65.53
NRST  (via drill 0.35)
  Top 0.203: 18.54,13.97 20.07,13.97 20.55,13.49 J1.10 | 20.57,22.61 20.98,23.01 20.98,30.84 v20.73,30.84
  Top 0.254: 18.54,13.97 17.78,13.97 17.27,14.48 17.27,16.26 16.51,17.02 15.21,17.02 | 15.21,17.02 v9.14,17.02 | BTN19.P$1 7.87,8.07 7.87,14.99 7.37,15.49 v7.11,15.49 | 15.21,17.02 15.21,19.28 15.49,19.56 16.76,19.56 19.81,22.61 20.57,22.61
  Bottom 0.254: v20.73,30.84 19.71,30.84 18.36,29.49 17.37,29.49 U1.7 | v9.14,17.02 7.62,15.49 v7.11,15.49
OUTA-L1  (via drill 0.35)
  Top 0.203: v18.59,26.15 18.66,26.21 19.15,26.21 19.66,26.72 19.66,28.4 19.1,28.96 19.1,30.94 18.29,31.75 18.29,32.59 18.19,32.69 v18.16,32.69
  Top 0.254: v18.39,35.33 18.29,35.43 18.29,37.59 20.04,39.34 v20.04,40.95 | v21.31,42.34 22.15,43.18 v22.15,47.14 | v22.15,51.21 33.93,51.21 34.57,50.57 34.57,47.27 v35.28,46.56 | v41.05,47.95 41.05,49.76 42.42,51.13 58.45,51.13 59,51.69 R3.1
  Bottom 0.203: U1.2 18,26.96 18.23,26.73 18.59,26.36 v18.59,26.15 | v18.16,32.69 18.16,33.09 18.26,33.19 18.26,35.2 v18.39,35.33
  Bottom 0.254: v20.04,40.95 21.31,42.22 v21.31,42.34 | v22.15,47.14 v22.15,51.21 | v35.28,46.56 35.56,46.84 39.93,46.84 v41.05,47.95
OUTA-L2  (via drill 0.35)
  Top 0.203: v18.85,27.01 v18.86,27.01 19.2,27.35 19.2,28.2 18.69,28.7 18.69,30.58 17.49,31.79 17.49,33.41 v17.63,33.56
  Top 0.254: v17.5,35.38 17.5,37.82 18.09,38.41 18.09,39.62 17.68,40.03 16.87,40.03 16.87,41.25 18.09,42.47 20.12,42.47 21.34,43.69 v21.34,48.16 | v21.13,53.85 23.29,56 R1.1
  Bottom 0.203: U1.3 18.08,27.46 18.38,27.16 18.7,27.16 v18.85,27.01 | v17.63,33.56 17.5,33.69 v17.5,35.38
  Bottom 0.254: v21.34,48.16 21.34,53.65 v21.13,53.85
OUTA-L3  (via drill 0.35)
  Top 0.203: v18.57,27.87 18.29,28.15 18.29,30.23 17.04,31.47 17.04,33.25 16.97,33.33 16.87,33.33 v16.64,33.55
  Top 0.254: R2.1 16.61,38.61 v16.61,35.38
  Bottom 0.203: v16.61,35.38 16.64,35.35 v16.64,33.55
  Bottom 0.254: U1.4 17.36,27.94 18.57,27.94 v18.57,27.87
OUTB-L1
  Bottom 0.203: U1.38 23.84,25.62 24.08,25.86 24.63,25.86 24.94,25.55 24.94,24.99
  Bottom 0.254: R4.2 25,24.94 24.94,24.99
OUTB-L2  (via drill 0.35)
  Top 0.254: v26.16,34.29 27.18,35.31 v36.32,35.31 | v43.74,35.36 47.36,35.36 R5.2
  Bottom 0.254: v36.32,35.31 43.69,35.31 v43.74,35.36 | v26.16,34.29 25.84,33.97 U1.25
OUTB-L3  (via drill 0.35)
  Top 0.254: v29.21,33.63 29.36,33.78 34.54,33.78 36.07,32.26 v36.32,32.26 | v41.4,32.51 41.4,32.26 41.15,32 41.15,27.2 v41.43,26.92
  Bottom 0.254: U1.29 25.85,29.97 26.92,29.97 27.94,30.99 27.94,32.26 29.21,33.53 v29.21,33.63 | v36.32,32.26 41.15,32.26 v41.4,32.51 | v41.43,26.92 46.08,26.92 R6.2
OUTD13  (via drill 0.35)
  Top 0.203: v19.86,29.11 20.07,28.91 20.07,25.91 18.54,24.38 v10.16,24.38
  Bottom 0.203: U1.5 17.38,28.5 19.25,28.5
  Bottom 0.254: v19.86,29.11 19.25,28.5 | v10.16,24.38 9.53,23.75 9.53,20.7 10.03,20.19 10.03,14.35 14,10.38 D13.K
OUTD14  (via drill 0.35)
  Top 0.203: v20.32,29.97 20.52,29.77 20.52,23.82 20.07,23.37 19.81,23.37 16.51,20.07 15.24,20.07 14.48,19.3 v14.48,18.8 | v22.1,10.41 22.35,10.16 v22.35,6.86 | v22.35,5.08 23.37,4.06 26.06,4.06 28.22,6.22 29.78,6.22 D14.K
  Bottom 0.203: v14.48,18.8 13.79,18.11 13.79,17.4 14.17,17.02 14.9,17.02 15.24,16.68 15.24,13.29 18.12,10.41 v22.1,10.41 | v22.35,6.86 v22.35,5.08
  Bottom 0.254: U1.6 17.36,28.98 18.52,28.98 19.51,29.97 v20.32,29.97
OUTD15  (via drill 0.35)
  Top 0.254: v27.18,33.68 27.18,34.19 27.79,34.8 35.81,34.8 v36.32,34.29 | v40.44,34.42 40.44,34.34 40.13,34.04 40.13,25.4 41.15,24.38 41.15,23.37 40.64,22.86 40.64,11.18 41.15,10.67 41.15,9.04 v41.29,9.18 | D15.K 46.4,6.6 v44.2,6.6
  Bottom 0.254: U1.26 25.87,31.49 26.59,31.49 26.92,31.83 26.92,33.43 v27.18,33.68 | v36.32,34.29 40.31,34.29 v40.44,34.42 | v41.29,9.18 43.87,6.6 v44.2,6.6
OUTD16  (via drill 0.35)
  Top 0.254: v28.17,33.68 28.17,34.01 28.45,34.29 35.31,34.29 v36.32,33.27 | v40.89,33.53 40.89,33.27 40.64,33.02 40.64,26.16 v40.89,25.91 | v54.36,14.99 56.64,12.7 56.64,8.13 57.15,7.62 62.38,7.62 D16.K
  Bottom 0.254: U1.27 25.87,30.99 26.92,30.99 27.43,31.5 27.43,32.82 28.17,33.55 v28.17,33.68 | v36.32,33.27 40.64,33.27 v40.89,33.53 | v40.89,25.91 46.23,25.91 49.78,22.35 49.78,21.59 54.36,17.02 v54.36,14.99
PB7  (via drill 0.35)
  Top 0.203: J1.7 19.53,16.26 18.11,16.26 17.07,17.3 17.07,18.09 v16.87,18.09
  Bottom 0.203: U1.43 21.34,24.18 21.03,23.88 21.03,21.84 20.32,21.13 19.69,21.13 17.1,18.55 17.1,18.31 v16.87,18.09
PB15  (via drill 0.35)
  Top 0.203: J1.5 22.18,18.54 23.37,19.73 | v23.62,30.48 23.57,30.53 23.57,32.31 22.78,33.1 19.53,33.1 18.41,34.21 15.8,34.21 15.72,34.14 v15.72,33.55 | v15.75,35.38 14.36,36.78 7.92,36.78 v7.72,36.98 | v6.1,36.98 1.22,36.98 0.62,37.58 BTN18.P$2
  Top 0.254: 23.37,19.73 23.37,20.12 22.35,21.13 22.35,29.72 23.11,30.48 v23.62,30.48
  Bottom 0.203: v15.72,33.55 15.72,35.62 15.75,35.59 v15.75,35.38 | v7.72,36.98 v6.1,36.98
  Bottom 0.254: v23.62,30.48 25.82,30.48 U1.28
ROW0
  Bottom 0.203: 20.83,33.47 20.83,35.66 19.1,37.39 14.11,37.39 R14.1
  Bottom 0.254: U1.17 20.83,33.47
ROW1
  Bottom 0.254: U1.19 21.84,36.83 21.08,37.59 R15.1
ROW2
  Bottom 0.203: U1.16 20.34,35.51 18.87,36.98 14.5,36.98 14.38,36.85 14.38,36.14 14.1,35.87 13.92,35.87 13.61,35.56 13.55,35.26
  Bottom 0.254: U1.16 | 13.55,35.26 R13.1
ROW3
  Bottom 0.254: U1.42 21.84,24.02 21.49,23.67 21.49,21.95 23.62,19.81 26.16,19.81 26.92,19.05 26.92,17.02 27.43,16.51 27.43,14.48 27.94,13.97 R19.2
SOUTH  (via drill 0.35)
  Top 0.203: v24.79,29.16 25.09,28.85 25.09,24.38 25.91,23.57 35.76,23.57
  Top 0.254: 35.76,23.57 36.12,23.57 v36.37,23.82 | v40.49,23.82 40.49,23.77 40.13,23.42 40.13,10.57 v40.44,10.26 | v38.86,8.53 39.47,7.92 39.47,4.54 SOUTH.2
  Bottom 0.203: U1.30 U1.31 24.99,28.96 v24.79,29.16
  Bottom 0.254: v36.37,23.82 v40.49,23.82 | v40.44,10.26 38.86,8.69 v38.86,8.53
SWDCLK  (via drill 0.35)
  Top 0.203: J1.4 22.83,16.26 24.38,16.26 25.4,17.27 25.4,19.3 23.11,21.59 v23.11,22.86
  Bottom 0.203: v23.11,22.86 23.88,23.62 24.38,23.62 24.38,24.92 U1.37
SWDIO  (via drill 0.35)
  Top 0.203: v23.88,27.69 23.88,21.59 25.91,19.56 25.91,17.02 25.15,16.26 25.15,15.75 24.13,14.73 J1.2
  Bottom 0.203: U1.34 25.81,27.43 24.13,27.43 v23.88,27.69
USB_DM
  Bottom 0.203: J2.2 8.14,55.23 11.33,58.42 18.8,58.42 23.88,53.34 27.94,53.34 32.51,48.77 32.51,40.89 33.27,40.13 33.27,34.8 26.94,28.46 U1.32
USB_DP
  Bottom 0.203: U1.33 27.2,27.96 33.78,34.54 33.78,40.39 33.02,41.15 33.02,49.02 28.19,53.85 24.13,53.85 19.05,58.93 11.18,58.93 8.13,55.88 J2.3
V+  (via drill 0.35)
  Top 0.203: J1.1 22.32,13.97 23.62,13.97
  Top 0.254: 23.62,13.97 24.64,13.97 25.35,13.26 25.35,10.11 24.64,9.4 | BTN17.P$2 7.56,30.17 v7.62,30.23
  Top 0.305: R7.2 24.64,6.36 v24.64,7.87 24.64,9.4 | R9.1 57.57,4.57 52.57,4.57 R10.1 50.54,2.54 38.86,2.54 38.23,3.17 38.23,6.22 37.85,6.6 36.07,6.6 35.69,6.22 35.69,3.17 35.05,2.54 33.27,2.54 v33.02,2.79
  Top 0.508: v31.7,37.74 v35.56,37.74 36.85,39.04 36.85,47.52 36.4,47.98 36.4,49.71 34.09,52.02 19,52.02 v18.92,51.94 | v7.62,30.23 v7.62,33.02 | v9.4,50.8 10.16,51.56 v13.72,51.56
  Bottom 0.254: 28.83,34.67 26.87,34.67 25.98,35.56 C2.2 | R7.2 24.54,6
  Bottom 0.305: U1.24 24.34,35.26 24.89,35.81 25.57,35.81 C2.2 | U1.36 28.15,26.46 C1.2 | U1.48 18.73,24.96 17.34,26.35 U1.1 15.03,26.46 C3.2 14.82,28.79 16.49,30.46 U1.9 | R8.2 21.54,3 24.54,6 | R7.2 27.95,3.05 32.77,3.05 v33.02,2.79
  Bottom 0.508: U2.2 16.93,46.03 C8.2 | U2.4 U2.2 | U2.2 16.51,46.99 17.53,48.01 19.56,48.01 19.81,47.75 19.81,44.7 20.57,43.94 26.42,43.94 29.72,40.64 29.72,37.74 | 28.83,34.67 29.72,35.56 29.72,37.74 | C1.2 28.36,26 28.7,25.65 32.77,25.65 35.36,28.25 35.36,37.54 v35.56,37.74 | v31.7,37.74 29.72,37.74 | v18.92,51.94 17.17,51.94 U2.4 | 11.94,28.7 14.73,28.7 14.82,28.61 C3.2 | v24.64,7.87 17.53,7.87 10.67,14.73 10.67,20.57 10.16,21.08 10.16,22.86 11.94,24.64 11.94,28.7 | v7.62,30.23 9.14,28.7 11.94,28.7 | v7.62,33.02 7.62,34.8 9.73,36.91 9.73,50.47 v9.4,50.8 | v13.72,51.56 15.47,51.56 U2.4
WEST  (via drill 0.35)
  Top 0.203: J1.8 20.04,15.49 v18.03,15.49 | 20.83,22.1 21.39,22.66 21.39,32 v21.13,32.26
  Top 0.254: v16,18.8 16.26,19.05 17.02,19.05 20.07,22.1 20.83,22.1 | v5.33,31.5 1.52,31.5 WEST.2
  Bottom 0.203: v18.03,15.49 16,17.53 v16,18.8
  Bottom 0.254: v21.13,32.26 19.71,32.26 18.91,31.46 U1.11 | U1.10 U1.11 | U1.11 16.65,31.46 14.53,29.34 9.78,29.34 7.62,31.5 v5.33,31.5

### Text on the board
tNames: Game of Life | bracz@ / 2023-06-23 | +5V | GLB | LOC | GND | GND | GND | L | LOC | G | GLB | +5V | +5V | +5V | GLB | LOC | GND